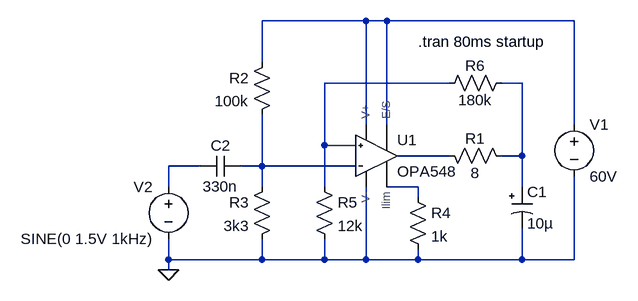
[diagram p0: schematic OPA548-jig.asc]
OPA548-jig.asc, the LTspice schematic file:
Version 4
SHEET 1 1104 680
WIRE 96 -80 -64 -80
WIRE 128 -80 96 -80
WIRE 416 -80 128 -80
WIRE -64 -16 -64 -80
WIRE 224 16 32 16
WIRE 336 16 304 16
WIRE 96 80 96 -80
WIRE 128 80 128 -80
WIRE 416 80 416 -80
WIRE 32 112 32 16
WIRE 80 112 32 112
WIRE 224 128 144 128
WIRE 336 128 336 16
WIRE 336 128 304 128
WIRE -160 144 -208 144
WIRE -64 144 -64 64
WIRE -64 144 -96 144
WIRE 80 144 -64 144
WIRE -208 176 -208 144
WIRE -64 176 -64 144
WIRE 32 176 32 112
WIRE 176 176 128 176
WIRE 336 176 336 128
WIRE 176 192 176 176
WIRE -208 288 -208 256
WIRE -64 288 -64 256
WIRE -64 288 -208 288
WIRE 32 288 32 256
WIRE 32 288 -64 288
WIRE 96 288 96 176
WIRE 96 288 32 288
WIRE 176 288 176 272
WIRE 176 288 96 288
WIRE 336 288 336 240
WIRE 336 288 176 288
WIRE 416 288 416 160
WIRE 416 288 336 288
WIRE -208 304 -208 288
FLAG -208 304 0
SYMBOL voltage 416 64 R0
WINDOW 123 0 0 Left 0
WINDOW 39 0 0 Left 0
SYMATTR InstName V1
SYMATTR Value 60V
SYMBOL res 208 112 M90
WINDOW 0 5 56 VBottom 2
WINDOW 3 27 56 VTop 2
SYMATTR InstName R1
SYMATTR Value 8
SYMBOL polcap 320 176 R0
WINDOW 3 24 56 Left 2
SYMATTR Value 10µ
SYMATTR InstName C1
SYMATTR Description Capacitor
SYMATTR Type cap
SYMATTR SpiceLine V=63
SYMBOL voltage -208 160 M0
WINDOW 123 0 0 Left 0
WINDOW 39 0 0 Left 0
SYMATTR InstName V2
SYMATTR Value SINE(0 1.5V 1kHz)
SYMBOL res -48 -32 M0
SYMATTR InstName R2
SYMATTR Value 100k
SYMBOL res -48 160 M0
SYMATTR InstName R3
SYMATTR Value 3k3
SYMBOL cap -160 128 M90
WINDOW 0 0 32 VBottom 2
WINDOW 3 32 32 VTop 2
SYMATTR InstName C2
SYMATTR Value 330n
SYMBOL res 160 176 R0
SYMATTR InstName R4
SYMATTR Value 1k
SYMBOL res 16 160 R0
SYMATTR InstName R5
SYMATTR Value 12k
SYMBOL res 320 0 R90
WINDOW 0 5 56 VBottom 2
WINDOW 3 27 56 VTop 2
SYMATTR InstName R6
SYMATTR Value 180k
SYMBOL _PERSONAL\\opamps\\OPA548 112 128 R0
SYMATTR InstName U1
TEXT 176 -48 Left 2 !.tran 80ms startup

The netlist it stands for:
* OPA548-jig.asc
V1 N001 0 60V
R1 N004 N003 8
C1 N003 0 10µ V=63
V2 N005 0 SINE(0 1.5V 1kHz)
R2 N001 N006 100k
R3 N006 0 3k3
C2 N005 N006 330n
R4 N007 0 1k
R5 N002 0 12k
R6 N003 N002 180k
XU1 N006 N002 N007 0 N001 N004 N001 OPA548  ; pins 1 2 Ilim V- V+ out E/S
.tran 80ms startup
.lib ..\sym\_PERSONAL\opamps\OPA548.sub
.backanno
.end